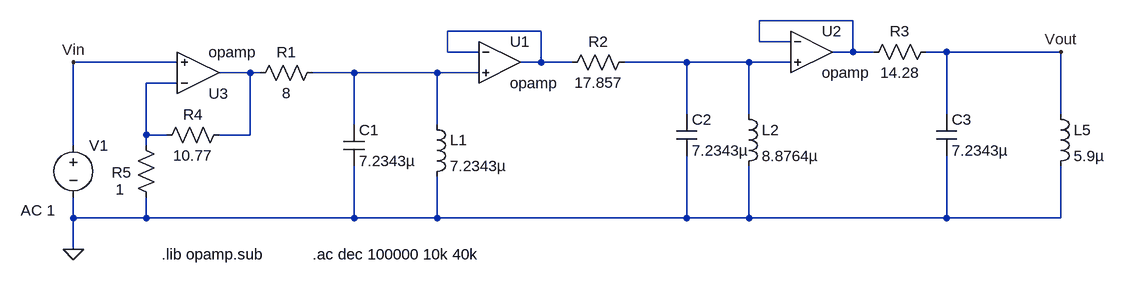
[diagram p0: schematic circuitoAcopladoDesnormalizado.asc]
circuitoAcopladoDesnormalizado.asc, the LTspice schematic file:
Version 4
SHEET 1 1244 680
WIRE 496 -128 352 -128
WIRE 16 -112 -128 -112
WIRE 352 -96 352 -128
WIRE 400 -96 352 -96
WIRE -128 -80 -128 -112
WIRE -80 -80 -128 -80
WIRE 496 -80 496 -128
WIRE 496 -80 464 -80
WIRE 528 -80 496 -80
WIRE 640 -80 608 -80
WIRE 816 -80 640 -80
WIRE -544 -64 -704 -64
WIRE 16 -64 16 -112
WIRE 16 -64 -16 -64
WIRE 64 -64 16 -64
WIRE 240 -64 144 -64
WIRE 336 -64 240 -64
WIRE 400 -64 336 -64
WIRE -432 -48 -480 -48
WIRE -416 -48 -432 -48
WIRE -272 -48 -336 -48
WIRE -144 -48 -272 -48
WIRE -80 -48 -144 -48
WIRE -544 -32 -592 -32
WIRE 240 16 240 -64
WIRE 336 16 336 -64
WIRE 640 16 640 -80
WIRE 816 16 816 -80
WIRE -272 32 -272 -48
WIRE -144 32 -144 -48
WIRE -592 48 -592 -32
WIRE -560 48 -592 48
WIRE -432 48 -432 -48
WIRE -432 48 -480 48
WIRE -704 64 -704 -64
WIRE -592 64 -592 48
WIRE -704 176 -704 144
WIRE -592 176 -592 144
WIRE -592 176 -704 176
WIRE -272 176 -272 96
WIRE -272 176 -592 176
WIRE -144 176 -144 112
WIRE -144 176 -272 176
WIRE 240 176 240 80
WIRE 240 176 -144 176
WIRE 336 176 336 96
WIRE 336 176 240 176
WIRE 640 176 640 80
WIRE 640 176 336 176
WIRE 816 176 816 96
WIRE 816 176 640 176
WIRE -704 224 -704 176
FLAG -704 224 0
FLAG -704 -64 Vin
FLAG 816 -80 Vout
SYMBOL voltage -704 48 R0
WINDOW 123 -81 116 Left 2
WINDOW 39 0 0 Left 0
SYMATTR Value2 AC 1
SYMATTR InstName V1
SYMATTR Value ""
SYMBOL res -320 -64 R90
WINDOW 0 0 56 VBottom 2
WINDOW 3 32 56 VTop 2
SYMATTR InstName R1
SYMATTR Value 8
SYMBOL cap -288 32 R0
SYMATTR InstName C1
SYMATTR Value 7.2343µ
SYMBOL ind -160 16 R0
SYMATTR InstName L1
SYMATTR Value 7.2343µ
SYMBOL res 160 -80 R90
WINDOW 0 0 56 VBottom 2
WINDOW 3 32 56 VTop 2
SYMATTR InstName R2
SYMATTR Value 17.857
SYMBOL cap 224 16 R0
SYMATTR InstName C2
SYMATTR Value 7.2343µ
SYMBOL ind 320 0 R0
SYMATTR InstName L2
SYMATTR Value 8.8764µ
SYMBOL res 624 -96 R90
WINDOW 0 0 56 VBottom 2
WINDOW 3 32 56 VTop 2
SYMATTR InstName R3
SYMATTR Value 14.28
SYMBOL cap 624 16 R0
SYMATTR InstName C3
SYMATTR Value 7.2343µ
SYMBOL OpAmps\\opamp -48 -128 R0
SYMATTR InstName U1
SYMBOL OpAmps\\opamp 432 -144 R0
SYMATTR InstName U2
SYMBOL ind 800 0 R0
SYMATTR InstName L5
SYMATTR Value 5.9µ
SYMBOL OpAmps\\opamp -512 16 M180
SYMATTR InstName U3
SYMBOL res -464 32 R90
WINDOW 0 0 56 VBottom 2
WINDOW 3 32 56 VTop 2
SYMATTR InstName R4
SYMATTR Value 10.77
SYMBOL res -608 48 R0
WINDOW 0 -37 58 Left 2
WINDOW 3 -31 84 Left 2
SYMATTR InstName R5
SYMATTR Value 1
TEXT -336 232 Left 2 !.ac dec 100000 10k 40k
TEXT -568 232 Left 2 !.lib opamp.sub

The netlist it stands for:
* circuitoAcopladoDesnormalizado.asc
V1 Vin 0 AC 1
R1 N005 N004 8
C1 N005 0 7.2343µ
L1 N005 0 7.2343µ
R2 N003 N002 17.857
C2 N003 0 7.2343µ
L2 N003 0 8.8764µ
R3 Vout N001 14.28
C3 Vout 0 7.2343µ
XU1 N002 N005 N002 opamp Aol=100K GBW=10Meg  ; pins invin noninvin out
XU2 N001 N003 N001 opamp Aol=100K GBW=10Meg  ; pins invin noninvin out
L5 Vout 0 5.9µ
XU3 N006 Vin N004 opamp Aol=100K GBW=10Meg  ; pins invin noninvin out
R4 N004 N006 10.77
R5 N006 0 1
.ac dec 100000 10k 40k
.lib opamp.sub
.backanno
.end